# EAGLE design Integrador (EAGLE 9.5.2)
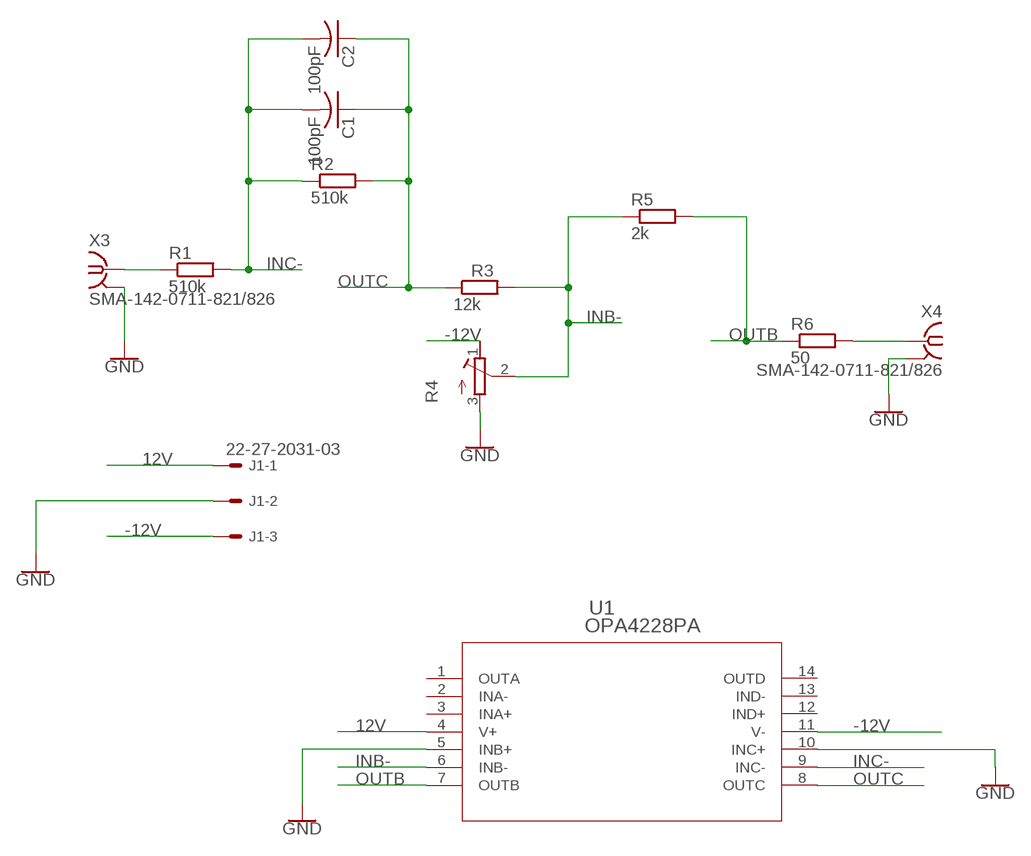
[diagram p0: schematic, sheet 1]

## Parts
C1  100pF  C-US025-030X050  [C025-030X050]
C2  100pF  C-US025-030X050  [C025-030X050]
J1  22-27-2031-03  [6410-03]
R1  510k  R-EU_0207/10  [0207/10]
R2  510k  R-EU_0207/10  [0207/10]
R3  12k  R-EU_0207/10  [0207/10]
R4  R-TRIMM3006P  [RTRIM3006P]
R5  2k  R-EU_0207/10  [0207/10]
R6  50  R-EU_0207/10  [0207/10]
U1  OPA4228PA  [N14]
X3  SMA-142-0711-821/826  [J502-ND-142-0711-821/826]
X4  SMA-142-0711-821/826  [J502-ND-142-0711-821/826]

## Nets
12V: J1.1 U1.4(V+)
-12V: J1.3 R4.1(E) U1.11(V-)
GND: J1.2 R4.3(A) U1.5(INB+) U1.10(INC+) X3.G@1 X3.G@2 X3.G@3 X3.G@4 X4.G@1 X4.G@2 X4.G@3 X4.G@4
INB-: R3.2 R4.2(S) R5.1 U1.6(INB-)
INC-: C1.2 C2.2 R1.2 R2.1 U1.9(INC-)
N$1: R1.1 X3.1
N$7: R6.2 X4.1
OUTB: R5.2 R6.1 U1.7(OUTB)
OUTC: C1.1 C2.1 R2.2 R3.1 U1.8(OUTC)
Unconnected: U1.1(OUTA) U1.2(INA-) U1.3(INA+) U1.12(IND+) U1.13(IND-) U1.14(OUTD)

## Library data of the parts
C1 C2 = rcl:C-US: CAPACITOR, American symbol; SPICEPREFIX: C
J1 = con-molex:22-?-03: CONNECTOR wire to board 2.54 mm (.1 inch) pitch header; MF: MOLEX; OC_FARNELL: unknown; OC_NEWARK: unknown
R1-R3 R5 R6 = rcl:R-EU_: RESISTOR, European symbol; SPICEPREFIX: R
R4 = rcl:R-TRIMM: Trimm resistor; SPICEMODEL: X; SPICEPREFIXL: POT
U1 = OPA4228:OPA4228PA; DATASHEET_URL: http://www.ti.com/lit/gpn/OPA4228; DESCRIPTION: High Precision, Low Noise Operational Amplifiers; FAMILY_NAME: LOW OFFSET VOLTAGE; GENERIC_PART_NUMBER: OPA4228; INDUSTRY_STD_PKG_TYPE: PDIP; MANUFACTURER: Texas Instruments; MANUFACTURER_PART_NUMBER: OPA4228PA; PACKAGE_DESIGNATOR: N; PIN_COUNT: 14; VENDOR: Texas Instruments
X3 X4 = con-coax:SMA-: SMA 50 Ohm End Launch Jack Receptacle - Round Contact Johnson Components Source: www.johnsoncomponents.com .. J502-ND.pdf; MF: JOHNSON COMPONENTS; MPN: 142-0711-821; OC_FARNELL: 1019328; OC_NEWARK: 16F3627

## Board
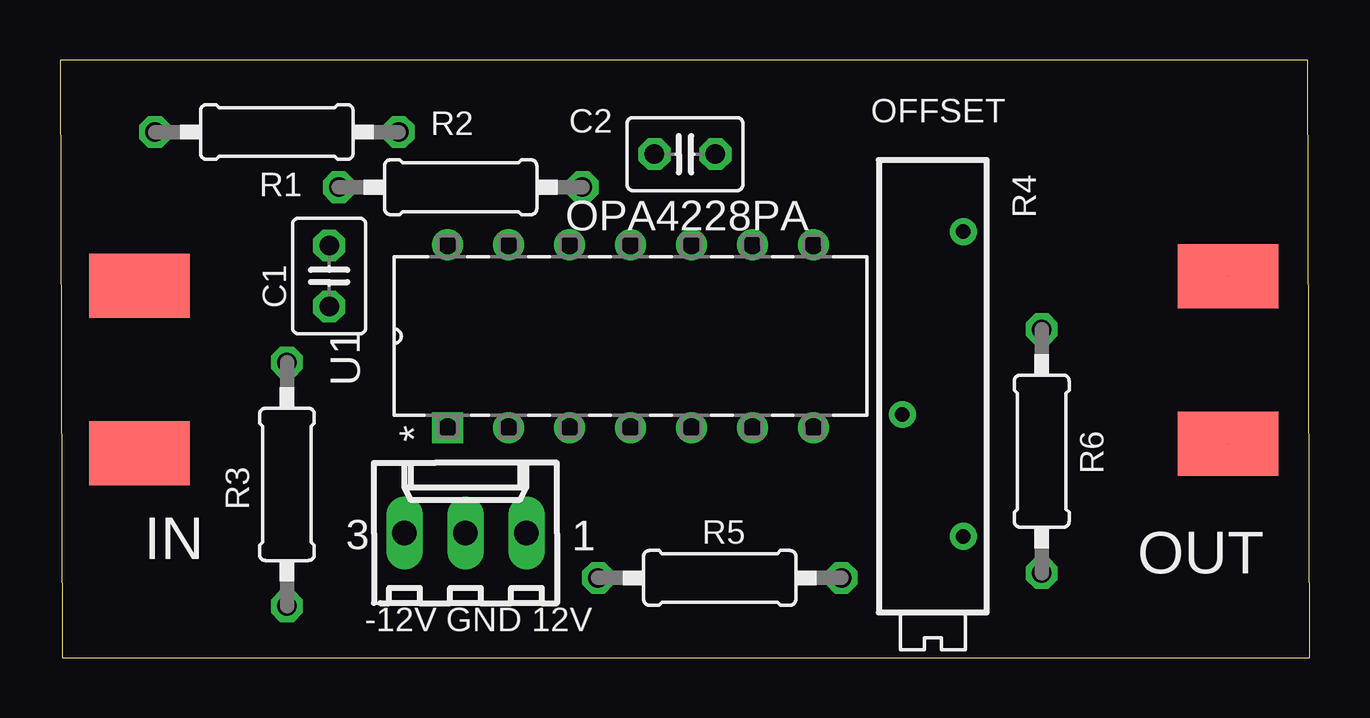
[diagram p1: board, top side]
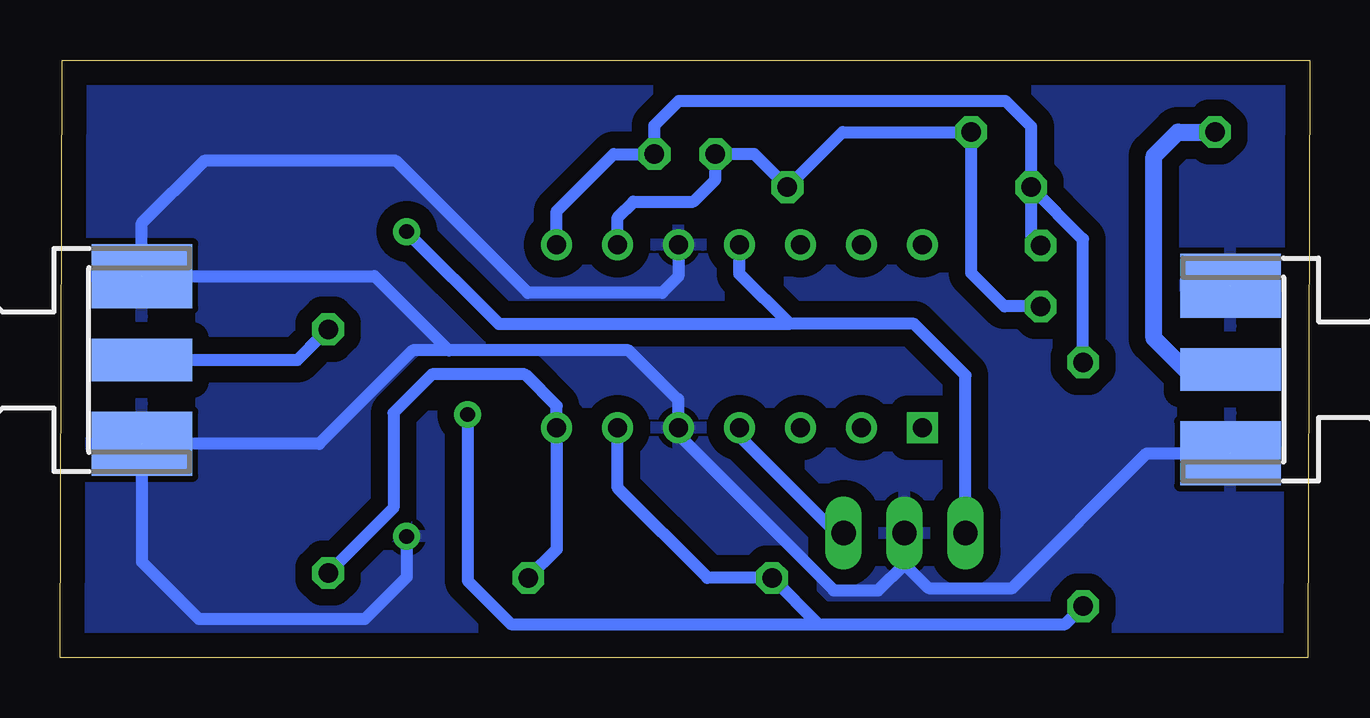
[diagram p2: board, bottom side, seen from below]

Size 52.1 x 24.9 mm. Coordinates in mm from the lower left corner, seen from the top.
Outline: 0.1,0 52.1,0 52,24.9 0,24.9 0.1,0
Copper layers (1*16): Top 0.035mm / dielectric 1.5mm / Bottom 0.035mm
Design rules "default": minimum track width 6mil, minimum drill 0.35mm, track to track 6mil, track to pad 6mil, pad to pad 6mil, via to via 6mil, smd to smd 6mil, copper to edge 40mil, drill to drill 6mil, minimum pad ring 10mil, minimum via ring 8mil, stop-mask expansion 4mil, vias tented up to drill 0mil, thermal gap 10mil

### Footprints (pad centres in the part's own frame; a part is rotated, then mirrored left to right if it is on the bottom)
C025-030X050 = drill 0.813 octagon: 1 -1.27,0; 2 1.27,0
6410-03 = drill 1.016 long: 1 2.54,0; 2 0,0; 3 -2.54,0
0207/10 = drill 0.813 octagon: 1 -5.08,0; 2 5.08,0
RTRIM3006P = drill 0.61: 1 -7.62,1.27; 2 0,-1.27; 3 5.08,1.27
N14 = drill 0.787 pad 1.295 square: 1 -7.62,15.24 | drill 0.787 pad 1.295: 2 -7.62,12.7; 3 -7.62,10.16; 4 -7.62,7.62; 5 -7.62,5.08; 6 -7.62,2.54; 7 -7.62,0; 8 0,0; 9 0,2.54; 10 0,5.08; 11 0,7.62; 12 0,10.16; 13 0,12.7; 14 0,15.24
J502-ND-142-0711-821/826 = smd 4.191 x 1.778: 1 2.115,0 | smd 4.191 x 2.667: G@1 2.115,3.495; G@2 2.115,-3.495 | smd 4.191 x 2.667 bottom: G@3 2.115,3.495; G@4 2.115,-3.495

### Placement (x,y rotation side)
C1  11.22,15.9 270 top
C2  26.05,20.98 180 top
J1  16.9,5.19 0 top
R1  9.04,21.9 0 top
R2  16.7,19.6 180 top
R3  9.46,7.22 270 top
R4  36.38,10.13 270 top
R5  27.5,3.32 0 top
R6  40.92,8.6 90 top
U1  31.4,17.2 90 top
X3  1.2,12 180 bottom
X4  50.8,12.4 0 bottom

### Tracks (layer width: path | path; a pad name or v marks a point on that pad's centre or on a via)
12V
  Bottom 0.5: U1.4 23.9,9.46 23.9,9.35 19.74,5.19 J1.1
-12V
  Bottom 0.5: R4.1 33.8,13.9 21.7,13.9 | J1.3 14.36,11.76 16.5,13.9 21.7,13.9 | U1.11 23.78,15.98 21.7,13.9
GND  (4 unrouted)
  Bottom 0.5: R4.3 37.65,3.35 39.4,1.6 46.3,1.6 48.69,3.98 X4.G@2 41.3,8.9 37.4,12.8 35.9,12.8 | 16.9,3.9 15.9,2.9 12.4,2.9 6.79,8.51 X3.G@3 | U1.5 26.32,10.78 | U1.5 26.32,10.72 28.4,12.8 35.9,12.8 | 35.9,12.8 39,15.89 X4.G@3 48.69,18.11 46.1,20.7 38.1,20.7 32.6,15.2 27,15.2 26.32,15.88 U1.10 | U1.5 26.32,9.28 19.84,2.8 18,2.8 16.9,3.9 | 16.9,3.9 J1.2
  pour Bottom (isolate 0.7): 0,0.2 0,24.9 52,24.9 52,0.2
INB-
  Bottom 0.5: R4.2 35.11,3.21 33.3,1.4 20.5,1.4 | 20.5,1.4 10.2,1.4 R3.2 | U1.6 28.86,7.06 25.12,3.32 R5.1 20.5,1.4
INC-
  Bottom 0.5: U1.9 28.86,18.34 28.2,19 25.7,19 24.78,19.92 C2.2 23.16,20.98 R2.1 19.48,21.9 R1.2 14.12,16.02 12.73,14.63 C1.2
N$1
  Bottom 0.7: X3.1 5.2,12 6.5,13.3 6.5,20.9 5.5,21.9 R1.1
N$7
  Bottom 0.5: R6.2 41.1,13.5 41.72,12.88 42.2,12.4 X4.1
OUTB
  Bottom 0.5: R6.1 38.2,6.24 38.2,10.2 36.6,11.8 32.72,11.8 31.4,10.48 U1.7 31.4,4.5 R5.2
OUTC
  Bottom 0.5: U1.8 31.4,18.6 29.02,20.98 C2.1 27.32,22.18 26.3,23.2 12.7,23.2 11.62,22.12 R2.2 | R3.1 9.46,17.44 R2.2 | C1.1 11.62,17.57 R2.2

### Text on the board
tNames: OFFSET | IN | OUT | -12V GND 12V